# Altium schematic sheet power.SchDoc
size A4; DocumentNumber: 2; SheetNumber: 2; SheetTotal: 7
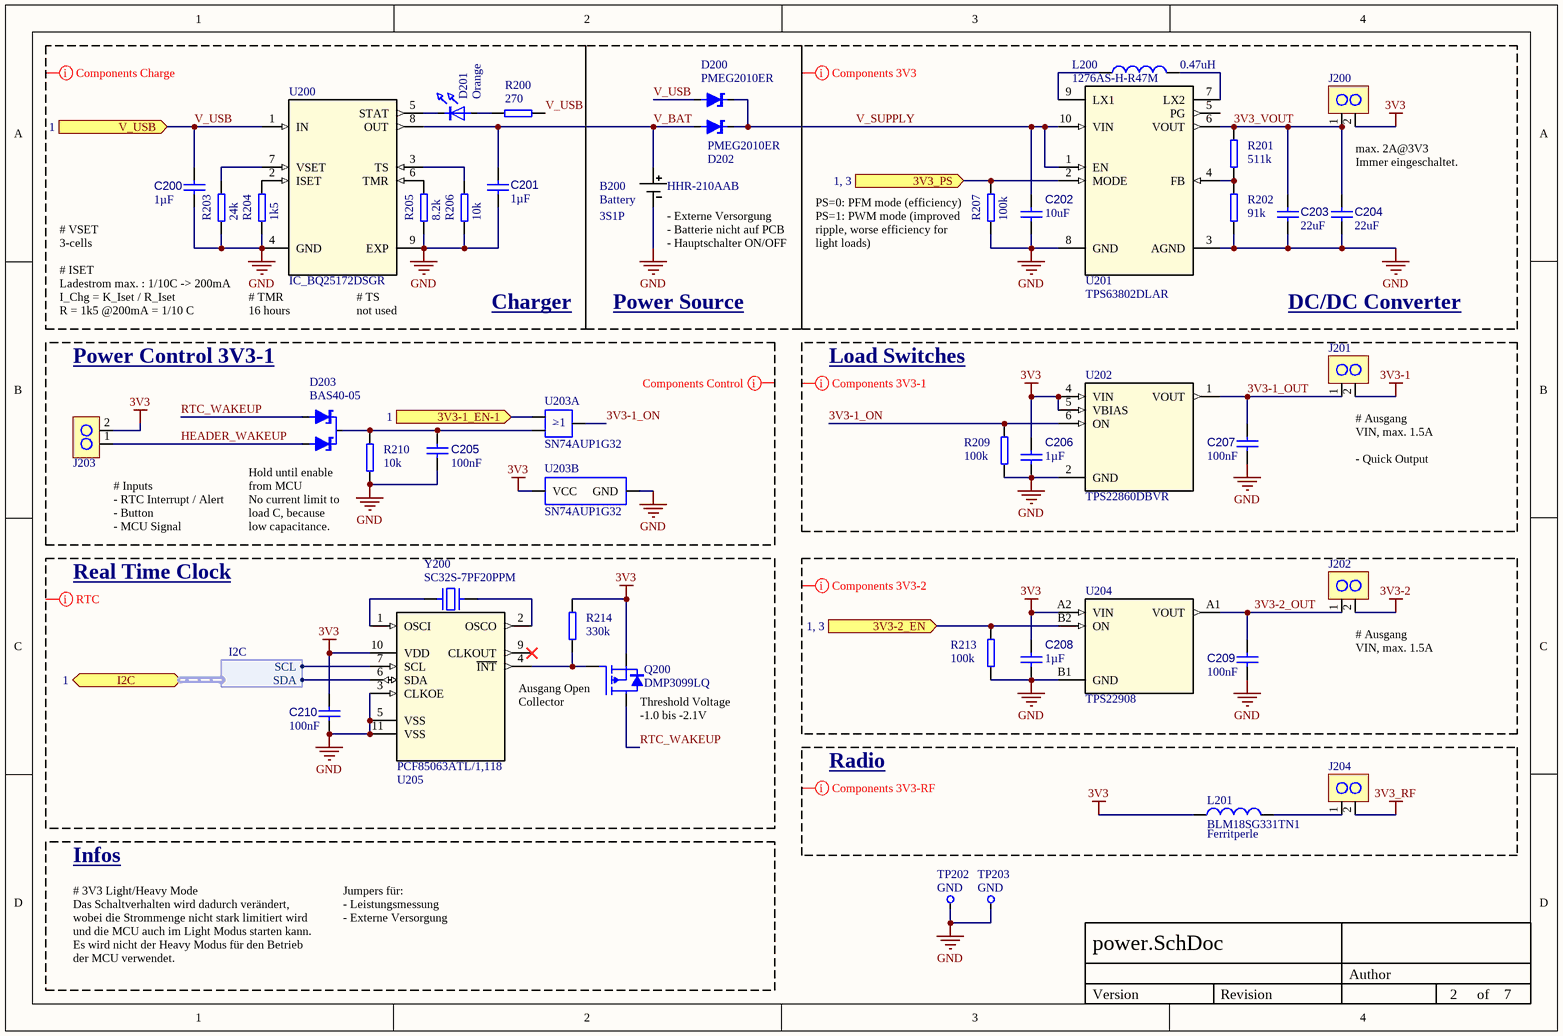
[diagram p0: power.SchDoc]

## Parts
B200  Battery  battery_config: 3S1P  product: HHR-210AAB  [JST-S2B-PH-K-S_V - Cloned]
C200  1µF  [0402]
C201  1µF  [0402]
C202  value 10uF  [0603]  (hidden comment: Capacitor 0402)
C203  value 22uF  [0603]  (hidden comment: Capacitor 0603)
C204  value 22uF  [0603]  (hidden comment: Capacitor 0603)
C205  100nF  [0603]
C206  1µF  [0603]
C207  100nF  [0603]
C208  1µF  [0603]
C209  100nF  [0603]
C210  value 100nF  [0402]  (hidden comment: Capacitor 0402)
D200  PMEG2010ER  [SODFL3517X110N]
D201  Orange  [0603-Diode]
D202  PMEG2010ER  [SODFL3517X110N]
D203  BAS40-05  [SOT-23]
J200  HEADER_2x1_TD  [HEADER_2_RM_2.54]  (value not drawn)
J201  HEADER_2x1_TD  [HEADER_2_RM_2.54]  (value not drawn)
J202  HEADER_2x1_TD  [HEADER_2_RM_2.54]  (value not drawn)
J203  HEADER_2x1_TD  [HEADER_2_RM_2.54]  (value not drawn)
J204  HEADER_2x1_TD  [HEADER_2_RM_2.54]  (value not drawn)
L200  0.47uH  name: 1276AS-H-R47M  [FP-XFL4015-MFG]
L201  BLM18SG331TN1  Info: Ferritperle  [1608X65N_BEADC]
Q200  DMP3099LQ  [SOT-23 - FET]
R200  270  [0603]
R201  511k  [0603]
R202  91k  [0603]
R203  24k  [0603]
R204  1k5  [0603]
R205  8.2k  [0603]
R206  10k  [0603]
R207  100k  [0603]
R209  100k  [0603]
R210  10k  [0603]
R213  100k  [0603]
R214  330k  [0603]
TP202  Name: GND  [TP+245X165]  (hidden comment: TP_SMD)
TP203  Name: GND  [TP+245X165]  (hidden comment: TP_SMD)
U200  IC_BQ25172DSGR  [IC_BQ25172DSGR]
U201  TPS63802DLAR  [VREG_TPS63802DLAR]
U202  TPS22860DBVR  [SOT95P280X145-6N]
U203  SN74AUP1G32  [SOT23-5]  (parts A,B of 2)
U204  TPS22908  [BGA4C50P2X2_88X88X62N]
U205  PCF85063ATL/1,118  [10-DFN(2.6X2.6)]
Y200  SC32S-7PF20PPM  [SC32S7PF20PPM]

## Blocks framed on the sheet
Power Source: B200 D200 D202

## Ports
3V3-1_EN-1 (in, see 1), 3V3-2_EN (in, see 1, 3), 3V3_PS (in, see 1, 3), I2C (bidir, harness I2C, see 1), V_USB (in, see 1)

## Harnesses
I2C: SCL, SDA

## Nets
3V3: C206.2 C208.2 C210.2 J200.2 J203.2 L201.1 Q200.S(SOURCE) R214.2 U202.4(VIN) U202.5(VBIAS) U203.5(VCC) U204.A2(VIN) U205.10(VDD)
3V3-1: J201.2
3V3-2: J202.2
3V3_RF: J204.2
GND: B200.2(-) C200.1 C201.1 C202.1 C203.1 C204.1 C205.1 C206.1 C207.1 C208.1 C209.1 C210.1 R202.2 R203.2 R204.2 R205.2 R206.2 R207.1 R209.2 R210.1 R213.2 TP202.1 TP203.1 U200.4(GND) U200.9(EXP) U201.3(AGND) U201.8(GND) U202.2(GND) U203.3(GND) U204.B1(GND) U205.3(CLKOE) U205.5(VSS) U205.11(VSS)
3V3-1_EN-1: U203.1(A) ; port 3V3-1_EN-1
3V3-1_ON: R209.1 U202.6(ON) U203.4(Y)
3V3-1_OUT: C207.2 J201.1 U202.1(VOUT)
3V3-2_EN: R213.1 U204.B2(ON) ; port 3V3-2_EN
3V3-2_OUT: C209.2 J202.1 U204.A1(VOUT)
3V3_PS: R207.2 U201.2(MODE) ; port 3V3_PS
3V3_VOUT: C203.2 C204.2 J200.1 R201.1 U201.6(VOUT)
HEADER_WAKEUP: D203.2(A) J203.1
RTC_WAKEUP: D203.1(A) Q200.D(DRAIN)
V_BAT: B200.1(+) C201.2 D202.A U200.8(OUT)
V_SUPPLY: C202.2 D200.K D202.K U201.1(EN) U201.10(VIN)
V_USB: C200.2 D200.A R200.2 U200.1(IN) ; port V_USB
NetC205_2: C205.2 D203.3(K) R210.2 U203.2(B)
NetD201_A: D201.A R200.1
NetD201_K: D201.K U200.5(STAT)
NetJ204_1: J204.1 L201.2
NetL200_1: L200.1 U201.9(LX1)
NetL200_2: L200.2 U201.7(LX2)
NetQ200_G: Q200.G(GATE) R214.1 U205.4(~{INT})
NetR201_2: R201.2 R202.1 U201.4(FB)
NetR203_1: R203.1 U200.7(VSET)
NetR204_1: R204.1 U200.2(ISET)
NetR205_1: R205.1 U200.6(TMR)
NetR206_1: R206.1 U200.3(TS)
NetU205_1: U205.1(OSCI) Y200.1
NetU205_2: U205.2(OSCO) Y200.2
NetU205_6: U205.6(SDA) ; port I2C.SDA
NetU205_7: U205.7(SCL) ; port I2C.SCL

Not connected (* = marked no-connect by the designer): U201 5(PG); U205 9(CLKOUT)*

## Layout directives
CompClassName: POWER_3V3-2: 3V3, 3V3-2, 3V3-2_OUT, GND
CompClassName: POWER_3V3-1: 3V3, 3V3-1, 3V3-1_ON, 3V3-1_OUT, GND
CompClassName: RTC: 3V3, GND, RTC_WAKEUP
CompClassName: POWER_3V3: 3V3, 3V3_VOUT, GND, V_SUPPLY
CompClassName: POWER_Charge: GND, V_USB
CompClassName: POWER_3V3-RF: 3V3, 3V3_RF
CompClassName: POWER_CONTROL: 3V3, 3V3-1_ON, GND, HEADER_WAKEUP, RTC_WAKEUP

## Notes on the sheet
- max. 2A@3V3
  Immer eingeschaltet.
- # VSET
  3-cells
- (near B200) - Externe Versorgung
  - Batterie nicht auf PCB
  - Hauptschalter ON/OFF
- (near R207) PS=0: PFM mode (efficiency)
  PS=1: PWM mode (improved ripple, worse efficiency for light loads)
- # ISET
  Ladestrom max. : 1/10C -> 200mA
  I_Chg = K_Iset / R_Iset
  R = 1k5 @200mA = 1/10 C
- (near U200) # TMR
  16 hours
- (near U200) # TS
  not used
- Charger
- DC/DC Converter
- Power Control 3V3-1
- Load Switches
- Hold until enable from MCU
- (near J201) # Ausgang
  VIN, max. 1.5A
  - Quick Output Discharge (QOD)
- Real Time Clock
- (near J203) # Inputs
  - RTC Interrupt / Alert
  - Button
  - MCU Signal
- No current limit to load C, because low capacitance.
- (near J202) # Ausgang
  VIN, max. 1.5A
- (near Q200) Ausgang Open Collector
- (near Q200) Threshold Voltage -1.0 bis -2.1V
- Radio
- Infos
- # 3V3 Light/Heavy Mode
  Das Schaltverhalten wird dadurch verändert, wobei die Strommenge nicht stark limitiert wird und die MCU auch im Light Modus starten kann. Es wird nicht der Heavy Modus für den Betrieb der MCU verwendet.
- Jumpers für:
  - Leistungsmessung
  - Externe Versorgung
- Author
- Version
- Revision
- of
- (in symbol Gatter OR1x2_1 SN74AUP1G32, part A) >1; _

## Library data of the parts
C200 C201 C203-C210 = C: Manufacturer: TDK; Manufacturer Part Number: C1005X6S0J105K050BC; Manufacturer: Murata; Manufacturer Part Number: GRM155R60J105KE19D; Manufacturer: Kyocera AVX; Manufacturer Part Number: 04026D105KAT2A; Voltage Rating: 6.3V; Tolerance: 10%; Mounting Technology: SM; Pins: 2; Case/Package: 0402; RoHS Compliant: True; Max Operating Temperature: 85°C; Component Type: Capacitors
  C200 C201 C206 C208: Value: 1µF
  C205 C207 C209: Value: 100nF
C202 = C: Manufacturer: TDK; Manufacturer Part Number: C1005X6S0J105K050BC; Manufacturer: Murata; Manufacturer Part Number: GRM155R60J105KE19D; Manufacturer: Kyocera AVX; Manufacturer Part Number: 04026D105KAT2A; Voltage Rating: 6.3V; Tolerance: 10%; Voltage: 25; Mounting Technology: SM; Pins: 2; Case/Package: 0402; RoHS Compliant: True; Max Operating Temperature: 85°C; Component Type: Capacitors
D200 D202 = Schotky_1: Value: PMEG2010ER; Supplier 1: Future Electronics; Supplier Part Number 1: 7040635
D201 = LED_1
D203 = Schotky_BAS40-5: Value: BAS40-05; Supplier 1: Mouser; Supplier Part Number 1: 726-BAS4005E6327HTSA
L200 = L?: Supplier: Mouser; Supplier Part Number: 81-1276AS-H-R47MP2; Supplier 1: Farnell; Supplier Part Number 1: 2289211
L201 = L?: 330 Ohms @ 100 MHz 1 Power Line Ferrite Bead 0603 (1608 Metric) 1.5A 70mOhm; Supplier 1: Mouser; Supplier Part Number 1: 81-BLM18SG331TN1D
Q200 = MOSFET P
R200-R207 R209 R210 R213 R214 = R?: Normaler Widerstand
  R200: Value: 270
  R202: Supplier: Mouser; Supplier Part Number: 595-TPS63802DLAR
TP202 TP203 = Testpoint
U200 = IC_BQ25172DSGR: Charge IC. 0.8-A, one- to six-cell NiMH stand-alone linear charger in a QFN package; MF: Texas Instruments; SnapEDA_Link: https://www.snapeda.com/parts/BQ25172DSGR/Texas+Instruments/view-part/?ref=snap; Package: None; Value: *; MP: BQ25172DSGR; Check_prices: https://www.snapeda.com/parts/BQ25172DSGR/Texas+Instruments/view-part/?ref=eda
U201 = TPS63802DLAR: MF: Richtek USA; MP: RT6150B-33GQW; SnapEDA_Link: https://www.snapeda.com/parts/RT6150B-33GQW/Richtek+USA+Inc./view-part/?ref=snap; Package: WFDFN-10 Richtek; Value: *; Check_prices: https://www.snapeda.com/parts/RT6150B-33GQW/Richtek+USA+Inc./view-part/?ref=eda
U202 = TPS22860DBVR: 0.73-?, 5-V, ultra-low leakage load switch 6-SOT-23 -40 to 85; MF: Texas Instruments; MP: TPS22860DBVR; SnapEDA_Link: https://www.snapeda.com/parts/TPS22860DBVR/Texas%20Instruments/view-part/473340/?ref=snap; Texas_Instruments-Purchase-URL: https://snapeda.com/shop?store=Texas+Instruments&id=473340; Value: *; Package: SOT-23-6 Texas Instruments; Digi-Key_Part_Number: 296-43982-1-ND
U203 = Gatter OR1x2_1 SN74AUP1G32: Value: SN74AUP1G32; Package: SOT-353; Distributor: Farnell; Distributor Nr.: 1085242; Supplier 1: Mouser; Supplier Part Number 1: 595-SN74AUP1G32DCKR
U204 = TPS22908: 3.6-V, 1-A, 28-mΩ On-Resistance Load Switch with Controlled Rise Time; MP: TPS22860DBVR; MF: Texas Instruments; SnapEDA_Link: https://www.snapeda.com/parts/TPS22860DBVR/Texas%20Instruments/view-part/473340/?ref=snap; Texas_Instruments-Purchase-URL: https://snapeda.com/shop?store=Texas+Instruments&id=473340; Value: TPS22908; Package: SOT-23-6 Texas Instruments; Digi-Key_Part_Number: 296-43982-1-ND
U205 = PCF85063ATL/1,118: Real Time Clock (RTC) IC Clock/Calendar - IÂ²C, 2-Wire Serial 10-XFDFN Exposed Pad; MF: NXP USA; SnapEDA_Link: https://www.snapeda.com/parts/PCF85063ATL/1,118/NXP+USA+Inc./view-part/?ref=snap; Availability: In Stock; MP: PCF85063ATL/1,118; Price: None; Package: DFN-10 NXP Semiconductors; Purchase-URL: https://pricing.snapeda.com/search/part/PCF85063ATL/1,118/?ref=eda; Value: *; Check_prices: https://www.snapeda.com/parts/PCF85063ATL/1,118/NXP+USA+Inc./view-part/?ref=eda
Y200 = Crystal_1: Crystal; Value: SC32S-7PF20PPM
J200-J204 = HEADER_2x1_TD: Supplier: Mouser; Supplier Part Number: 471-SMARACONNECTORWP